# EAGLE design Tempest (EAGLE 6.6.0)

## Sheet 1 of 3
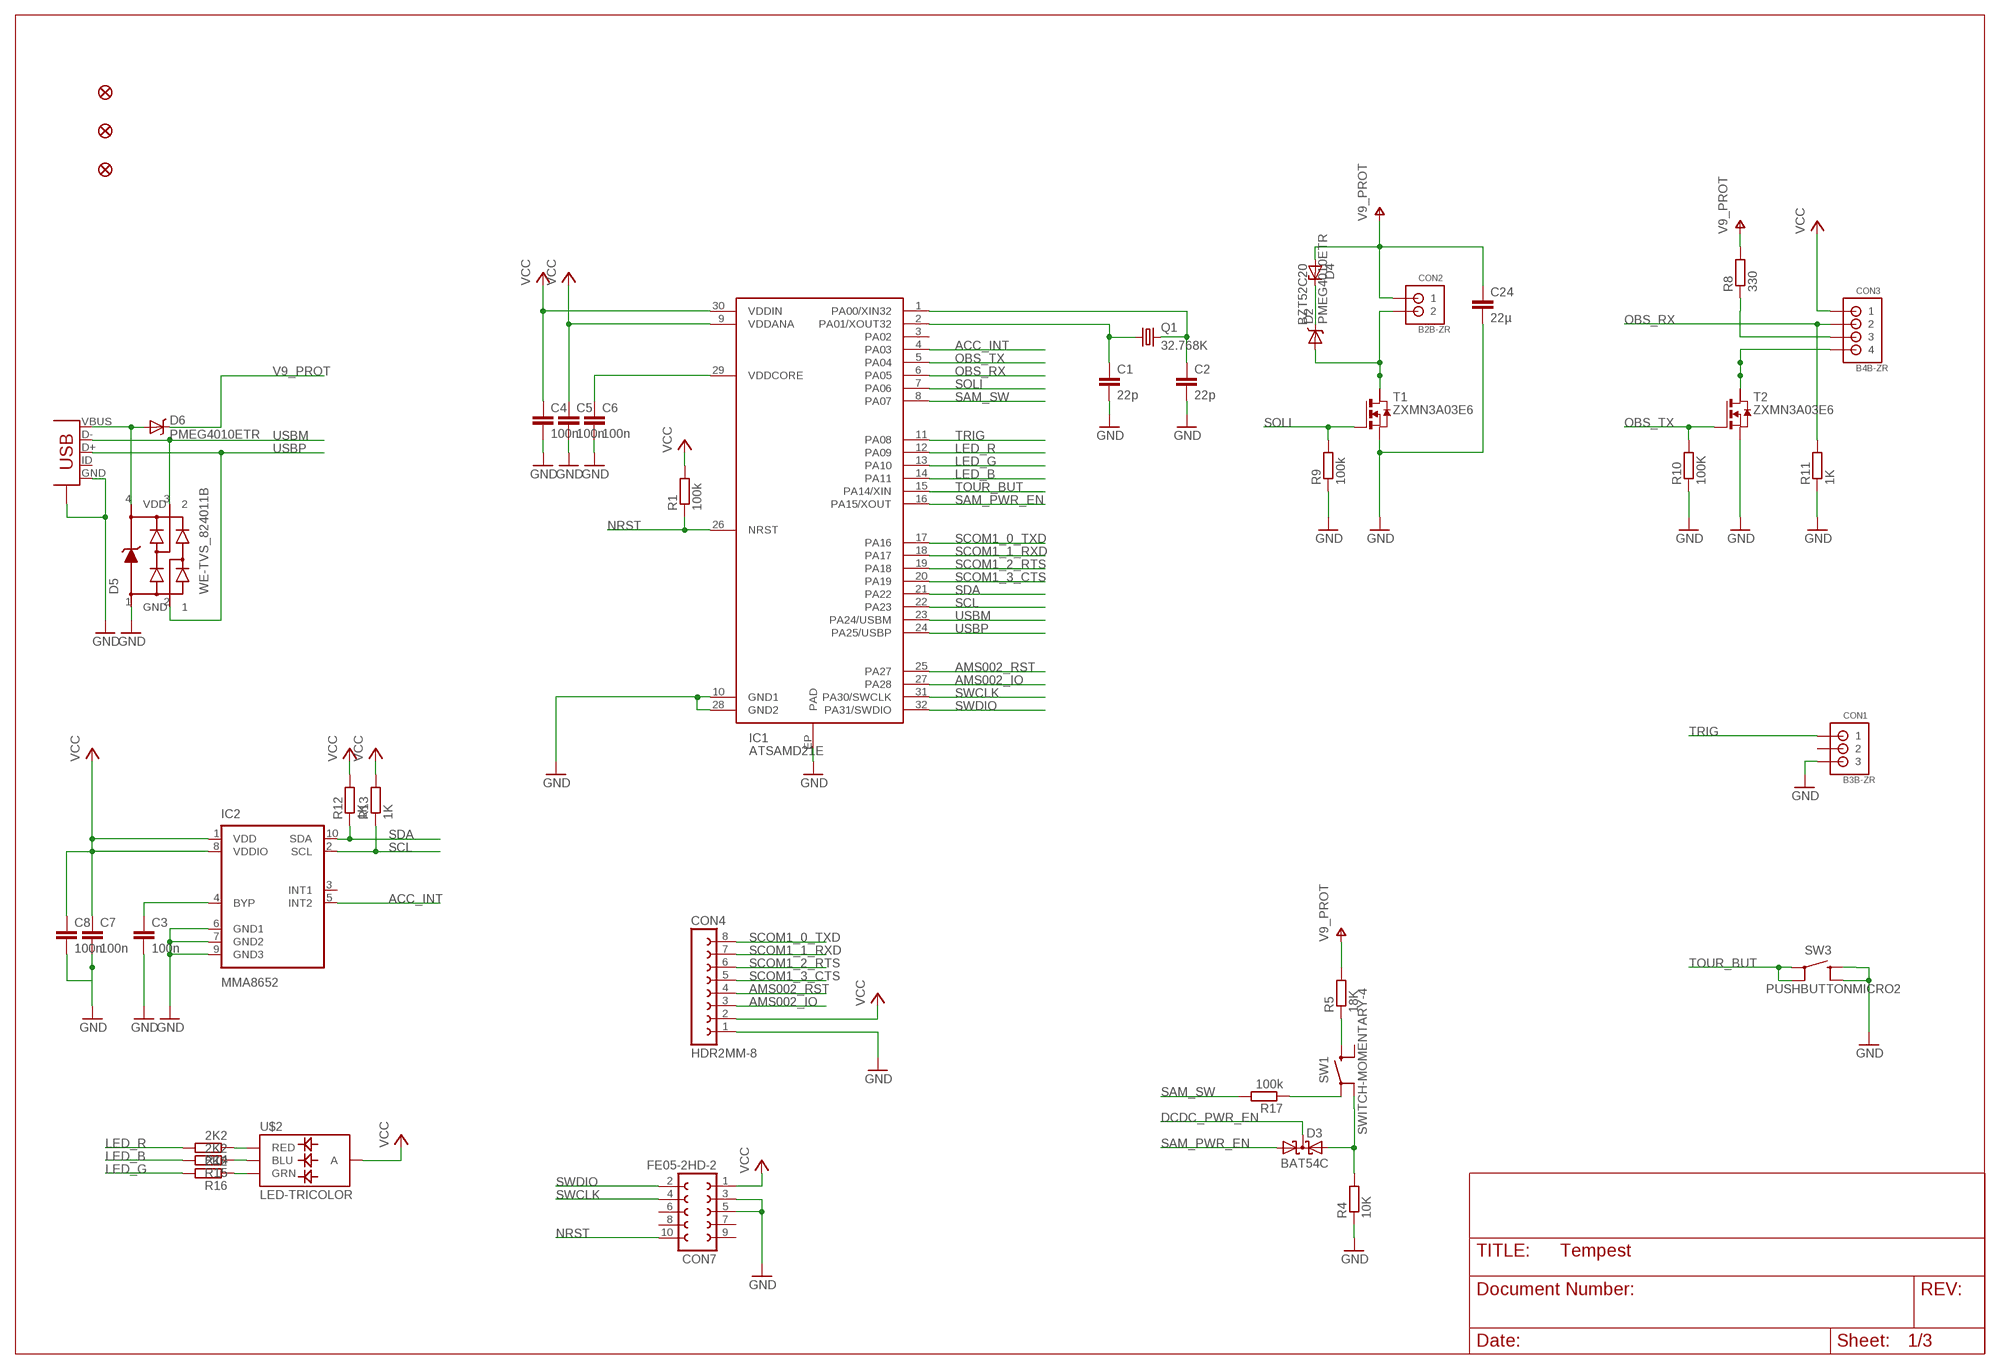
[diagram p0: schematic, sheet 1]

### Parts
C1  22p  C0603  [_0603MP]
C2  22p  C0603  [_0603MP]
C3  100n  C0603  [_0603MP]
C4  100n  C0603  [_0603MP]
C5  100n  C0603  [_0603MP]
C6  100n  C0603  [_0603MP]
C7  100n  C0603  [_0603MP]
C8  100n  C0603  [_0603MP]
C24  22µ  C-EUC1206  [C1206]
CON1  B3B-ZR  [S3B-ZR]
CON2  B2B-ZR  [S2B-ZR]
CON3  B4B-ZR  [S4B-ZR]
CON4  HDR2MM-8  [HDR2MM-8]
CON6  USB-MICRO-A  [USB-MICROB]
CON7  FE05-2HD-2  [FE02-2-HD-2]
D2  PMEG4010ETR  DIODE-SCHOTTKYSOD123  [SOD123]
D3  BAT54C  [SOT23]
D4  BZT52C20  ZENER-DIODESOD123  [SOD123]
D5  WE-TVS_824011B  [AUTOPILOT_SOT143B]
D6  PMEG4010ETR  DIODE-SCHOTTKYSOD123  [SOD123]
FID1  FIDUCIALUFIDUCIAL  [MICRO-FIDUCIAL]
FID2  FIDUCIALUFIDUCIAL  [MICRO-FIDUCIAL]
FID6  FIDUCIALUFIDUCIAL  [MICRO-FIDUCIAL]
IC1  ATSAMD21E  [QFN-32]
IC2  MMA8652  [DFN-10]
Q1  32.768K  CRYSTAL32X15  [XTAL_32X15]
R1  100k  R0603  [_0603MP]
R4  10K  R0603  [_0603MP]
R5  18K  R0603  [_0603MP]
R8  330  R-EU_R0805  [R0805]
R9  100k  R0603  [_0603MP]
R10  100K  R0603  [_0603MP]
R11  1K  R0603  [_0603MP]
R12  1K  R0603  [_0603MP]
R13  1K  R0603  [_0603MP]
R14  2K2  R0603  [_0603MP]
R15  2K2  R0603  [_0603MP]
R16  2K2  R0603  [_0603MP]
R17  100k  R0603  [_0603MP]
SW1  SWITCH-MOMENTARY-4  [TACTILE_SWITCH_TALL]
SW3  PUSHBUTTONMICRO2  [PUSHBUTTON-MICRO2]
T1  ZXMN3A03E6  NMOSSOT23-6  [SOT23-6]
T2  ZXMN3A03E6  NMOSSOT23-6  [SOT23-6]
U$2  LED-TRICOLOR  [LED-TRICOLOR-SMD]

### Nets
ACC_INT: IC1.4(PA03) IC2.5(INT2)
AMS002_IO: CON4.3 IC1.27(PA28)
AMS002_RST: CON4.4 IC1.25(PA27)
DCDC_PWR_EN: D3.3(CC) ; also sheet 3
GND: C1.2 C2.2 C3.2 C4.2 C5.2 C6.2 C7.2 C8.2 C24.2 CON1.3 CON4.1 CON6.GND CON6.GND@1(GND) CON7.3 CON7.5 D5.1(GND) IC1.10(GND1) IC1.28(GND2) IC1.EP(PAD) IC2.6(GND1) IC2.7(GND2) IC2.9(GND3) R4.1 R9.1 R10.1 R11.1 SW3.2A SW3.2B(2A) T1.4(S) T2.4(S) ; also sheet 3
LED_B: IC1.14(PA11) R15.2
LED_G: IC1.13(PA10) R16.2
LED_R: IC1.12(PA09) R14.2
N$1: C2.1 IC1.1(PA00/XIN32) Q1.2
N$2: C6.1 IC1.29(VDDCORE)
N$3: C1.1 IC1.2(PA01/XOUT32) Q1.1
N$5: D3.2(A2) R4.2 SW1.A2(1A)
N$6: CON2.2 D2.A T1.1(D) T1.2(D1) T1.6(D3)
N$7: R5.1 SW1.B1
N$8: R17.1 SW1.A1
N$10: C3.1 IC2.4(BYP)
N$15: CON3.4 T2.1(D) T2.2(D1) T2.6(D3)
N$16: CON3.3 R8.1
N$18: D2.C D4.C
N$25: CON6.VBUS D5.4(VDD) D6.A
N$30: R14.1 U$2.2(RED)
N$31: R15.1 U$2.3(BLU)
N$32: R16.1 U$2.4(GRN)
NRST: CON7.10 IC1.26(NRST) R1.1
OBS_RX: CON3.2 IC1.6(PA05) R11.2
OBS_TX: IC1.5(PA04) R10.2 T2.3(G)
SAM_PWR_EN: D3.1(A1) IC1.16(PA15/XOUT)
SAM_SW: IC1.8(PA07) R17.2
SCL: IC1.22(PA23) IC2.2(SCL) R13.1
SCOM1_0_TXD: CON4.8 IC1.17(PA16)
SCOM1_1_RXD: CON4.7 IC1.18(PA17)
SCOM1_2_RTS: CON4.6 IC1.19(PA18)
SCOM1_3_CTS: CON4.5 IC1.20(PA19)
SDA: IC1.21(PA22) IC2.10(SDA) R12.1
SOLI: IC1.7(PA06) R9.2 T1.3(G)
SWCLK: CON7.4 IC1.31(PA30/SWCLK)
SWDIO: CON7.2 IC1.32(PA31/SWDIO)
TOUR_BUT: IC1.15(PA14/XIN) SW3.1A SW3.1B(1A)
TRIG: CON1.1 IC1.11(PA08)
USBM: CON6.D- D5.3 IC1.23(PA24/USBM)
USBP: CON6.D+ D5.2 IC1.24(PA25/USBP)
V9_PROT: C24.1 CON2.1 D4.A D6.C R5.2 R8.2 ; also sheet 3
VCC: C4.1 C5.1 C7.1 C8.1 CON3.1 CON4.2 CON7.1 IC1.9(VDDANA) IC1.30(VDDIN) IC2.1(VDD) IC2.8(VDDIO) R1.2 R12.2 R13.2 U$2.1(A) ; also sheet 3
Unconnected: CON1.2 CON6.ID CON7.6 CON7.7 CON7.8 CON7.9 IC1.3(PA02) IC2.3(INT1) SW1.B2(2A) T1.5(D2) T2.5(D2)

## Sheet 2 of 3
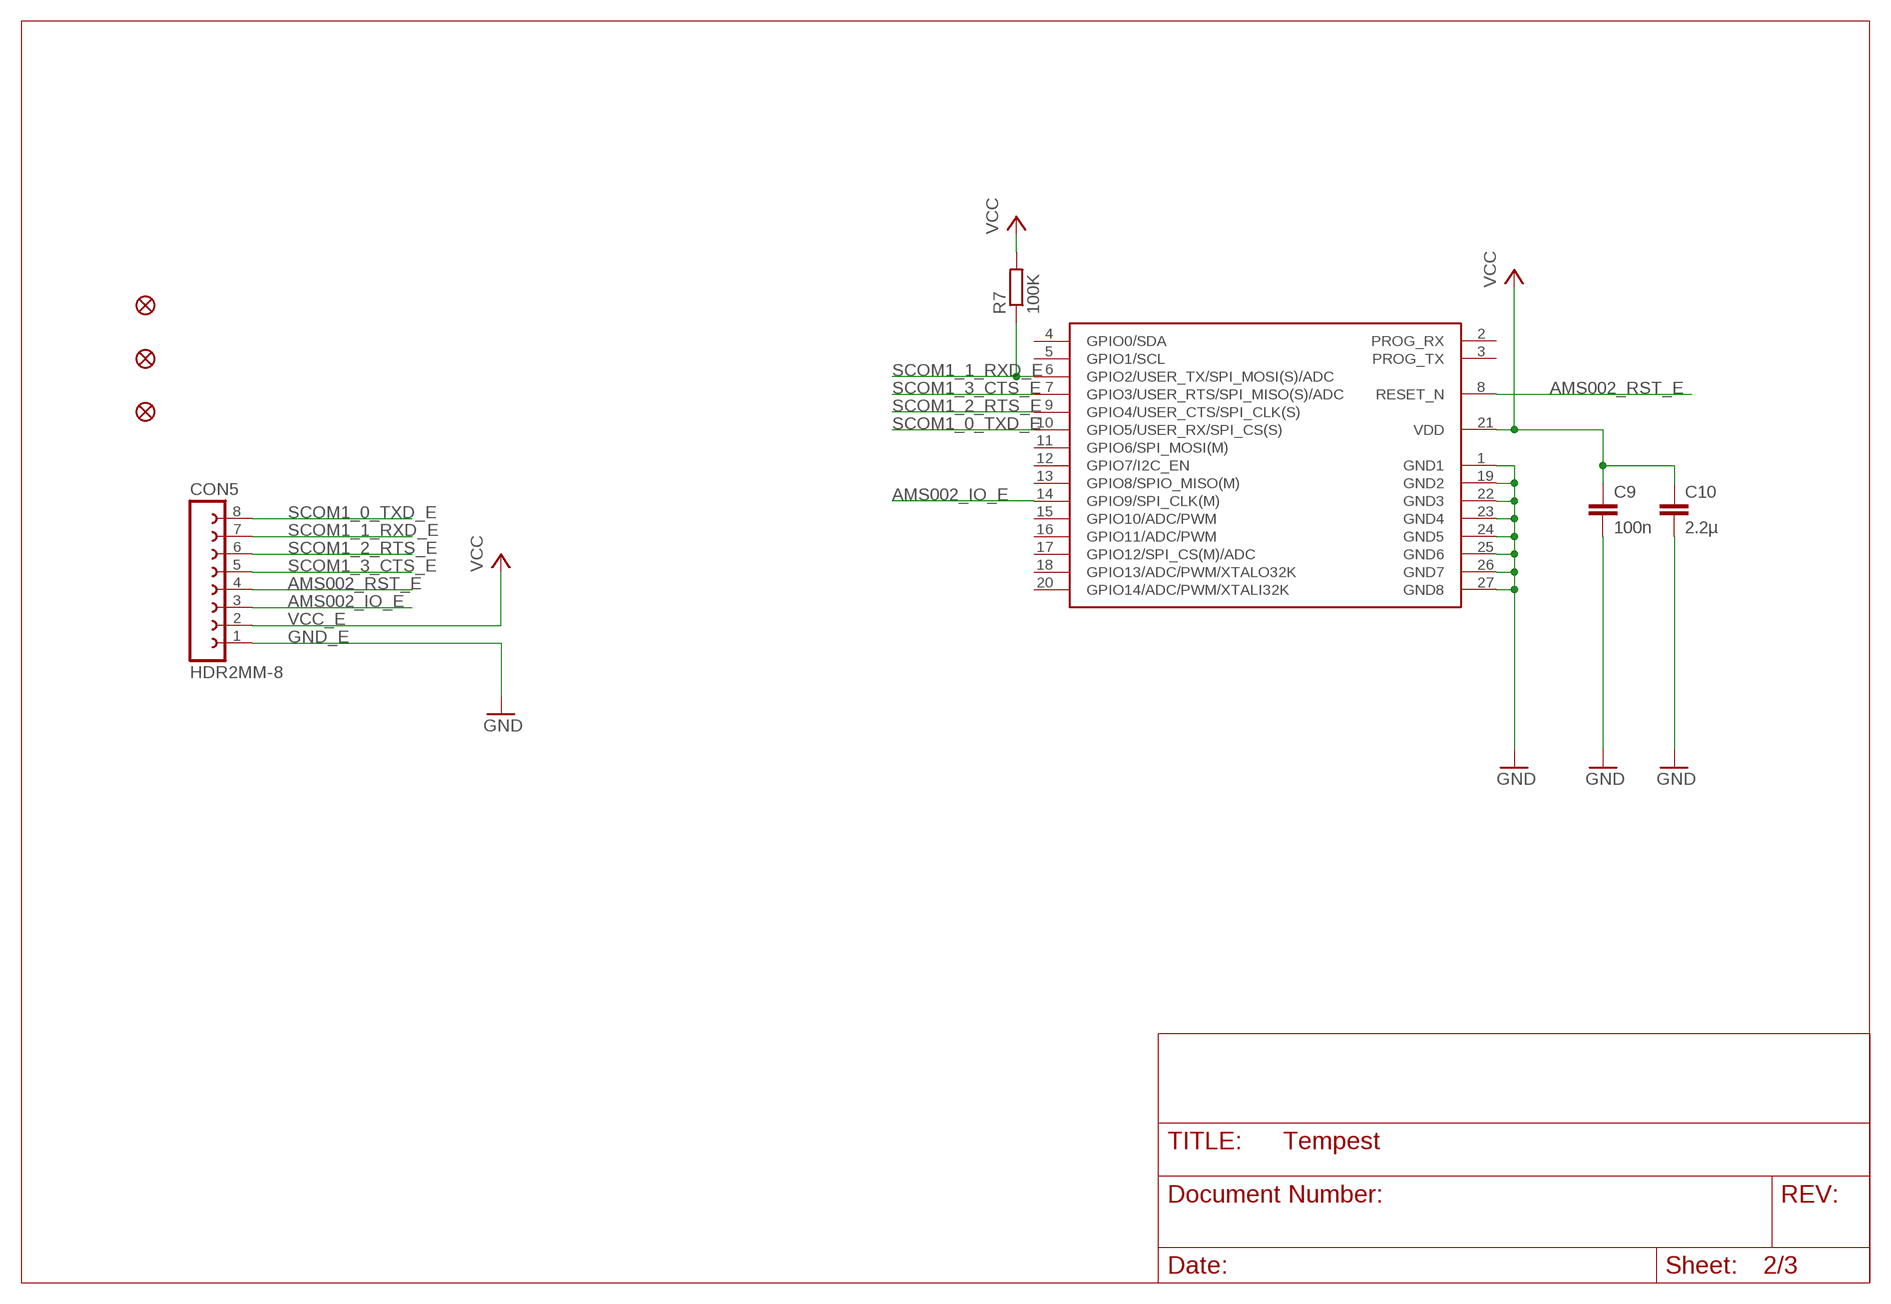
[diagram p1: schematic, sheet 2]

### Parts
C9  100n  C0603  [_0603MP]
C10  2.2µ  C0603  [_0603MP]
CON5  HDR2MM-8  [HDR2MM-8]
FID3  FIDUCIALUFIDUCIAL  [MICRO-FIDUCIAL]
FID4  FIDUCIALUFIDUCIAL  [MICRO-FIDUCIAL]
FID5  FIDUCIALUFIDUCIAL  [MICRO-FIDUCIAL]
R7  100K  R0603  [_0603MP]
U$1  AMS002  [AMS00X]

### Nets
AMS002_IO_E: CON5.3 U$1.14(GPIO9/SPI_CLK(M))
AMS002_RST_E: CON5.4 U$1.8(RESET_N)
GND_E: C9.2 C10.2 CON5.1 U$1.1(GND1) U$1.19(GND2) U$1.22(GND3) U$1.23(GND4) U$1.24(GND5) U$1.25(GND6) U$1.26(GND7) U$1.27(GND8) ; supply symbol labelled GND
SCOM1_0_TXD_E: CON5.8 U$1.10(GPIO5/USER_RX/SPI_CS(S))
SCOM1_1_RXD_E: CON5.7 R7.1 U$1.6(GPIO2/USER_TX/SPI_MOSI(S)/ADC)
SCOM1_2_RTS_E: CON5.6 U$1.9(GPIO4/USER_CTS/SPI_CLK(S))
SCOM1_3_CTS_E: CON5.5 U$1.7(GPIO3/USER_RTS/SPI_MISO(S)/ADC)
VCC_E: C9.1 C10.1 CON5.2 R7.2 U$1.21(VDD) ; supply symbol labelled VCC
Unconnected: U$1.2(PROG_RX) U$1.3(PROG_TX) U$1.4(GPIO0/SDA) U$1.5(GPIO1/SCL) U$1.11(GPIO6/SPI_MOSI(M)) U$1.12(GPIO7/I2C_EN) U$1.13(GPIO8/SPIO_MISO(M)) U$1.15(GPIO10/ADC/PWM) U$1.16(GPIO11/ADC/PWM) U$1.17(GPIO12/SPI_CS(M)/ADC) U$1.18(GPIO13/ADC/PWM/XTALO32K) U$1.20(GPIO14/ADC/PWM/XTALI32K)

## Sheet 3 of 3
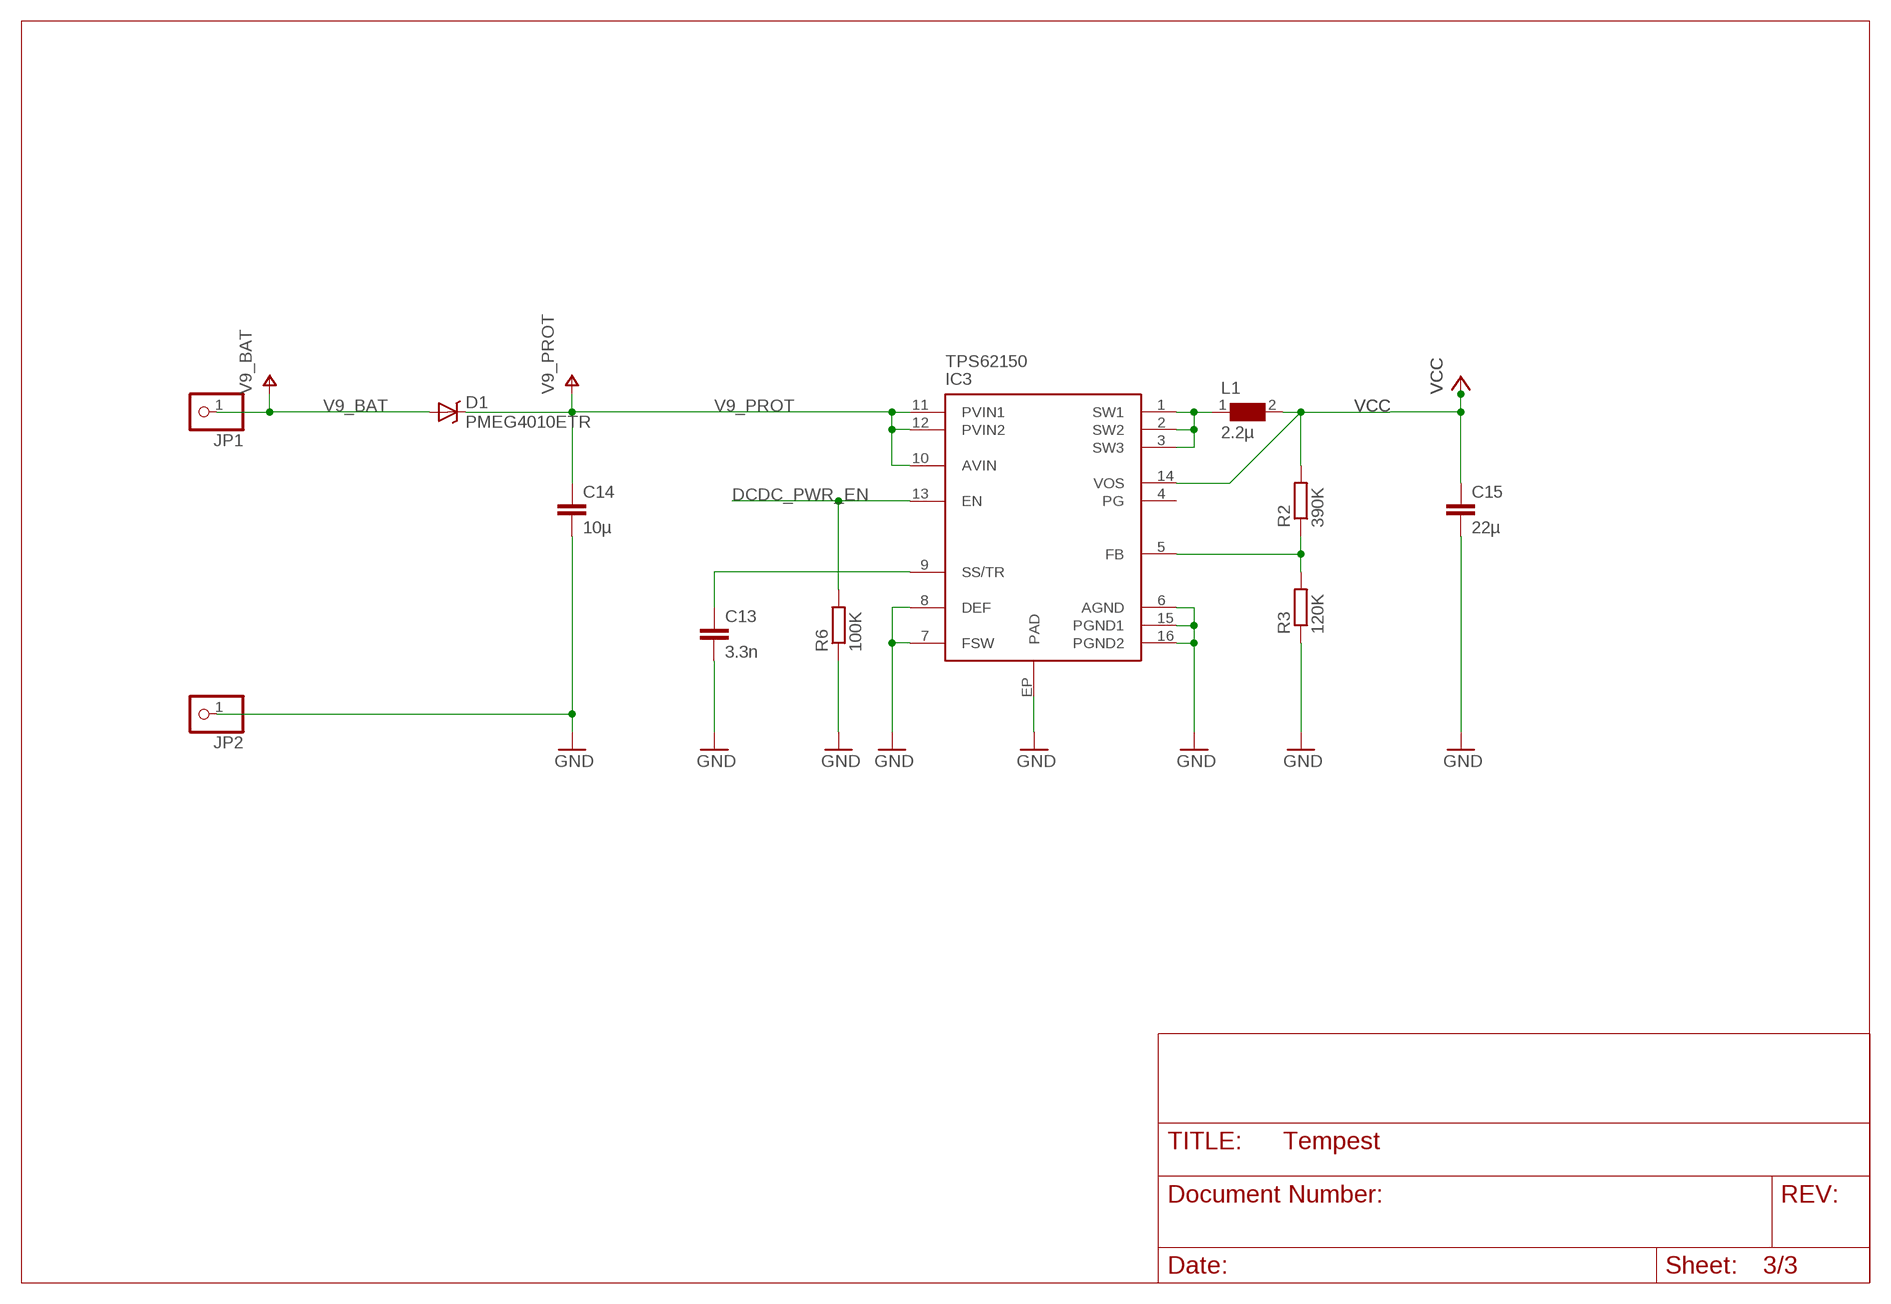
[diagram p2: schematic, sheet 3]

### Parts
C13  3.3n  C0603  [_0603MP]
C14  10µ  C-EUC1206  [C1206]
C15  22µ  C-EUC1206  [C1206]
D1  PMEG4010ETR  DIODE-SCHOTTKYSOD123  [SOD123]
IC3  TPS62150  [QFN-16]
JP1  PINHD-1X1  [1X01]
JP2  PINHD-1X1  [1X01]
L1  2.2µ  WE-TPC_2828  [WE-TPC_2828]
R2  390K  R0603  [_0603MP]
R3  120K  R0603  [_0603MP]
R6  100K  R0603  [_0603MP]

### Nets
DCDC_PWR_EN: IC3.13(EN) R6.2 ; also sheet 1
GND: C13.2 C14.2 C15.2 IC3.6(AGND) IC3.7(FSW) IC3.8(DEF) IC3.15(PGND1) IC3.16(PGND2) IC3.EP(PAD) JP2.1 R3.1 R6.1 ; also sheet 1
N$17: C13.1 IC3.9(SS/TR)
N$19: IC3.1(SW1) IC3.2(SW2) IC3.3(SW3) L1.1
N$20: IC3.5(FB) R2.1 R3.2
V9_BAT: D1.A JP1.1
V9_PROT: C14.1 D1.C IC3.10(AVIN) IC3.11(PVIN1) IC3.12(PVIN2) ; also sheet 1
VCC: C15.1 IC3.14(VOS) L1.2 R2.2 ; also sheet 1
Unconnected: IC3.4(PG)

## Power pins joined to a net without a drawn wire
GND: CON6.GND@2(GND) CON6.GND@3(GND) CON6.GND@4(GND) CON6.GND@5(GND) CON6.GND@6(GND)

## Library data of the parts
C1-C10 C13 = squirrel:C
C14 C15 C24 = squirrel:C-EU: CAPACITOR, European symbol
CON1 = squirrel:B3B-ZR: JST-ZH Connector 3 pol, 1.5mm pitch Package: B3B-ZR Source: http://www.jst-mfg.com/product/pdf/eng/eZH.pdf
CON2 = squirrel:B2B-ZR
CON3 = squirrel:B4B-ZR: JST-ZH Connector 4 pol, 1.5mm pitch Package: B4B-ZR Source: http://www.jst-mfg.com/product/pdf/eng/eZH.pdf
CON4 CON5 = squirrel:HDR2MM-8
CON6 = squirrel:USB-MICRO-A
CON7 = squirrel:FE05-2: FEMALE HEADER
D1 D2 D6 = squirrel:DIODE-SCHOTTKY: Commonly MBRA140.
D3 = diode:BAT54C: Schottky Diodes Source: Fairchild .. BAT54.pdf
D4 = squirrel:ZENER-DIODE: Z-Diode
D5 = squirrel:WE-TVS_824011: TVS Diode Array WE-TVS, High Speed Series - Low capazity - No leakage current - Low clamping voltage - high ESD voltage protection -- USB 1.0 - 2.0
FID1-FID6 = squirrel:FIDUCIAL: Fiducial Alignment Points Various fiducial points for machine vision alignment.
IC1 = squirrel:ATSAMD21E
IC2 = squirrel:MMA8652
IC3 = squirrel:TPS62150
JP1 JP2 = pinhead:PINHD-1X1: PIN HEADER
L1 = squirrel:WE-TPC: Shielded Tiny Power Inductor WE-TPC - Extremely flat power inductor - High current capability - High reliability and perfect soldering characteristics because of integrated soldering pad - magnetically shielded -- Portable power like PDA, digital camera, PCMICA-cards and displays -- DC/DC-converter -- Recommended for switching regulator IC's from Linear Technology, National Semiconductor, Texas Instruments and Fairchild Semiconductor
Q1 = squirrel:CRYSTAL: CRYSTAL
R1-R7 R9-R17 = squirrel:R
R8 = squirrel:R-EU_: RESISTOR, European symbol
SW1 = squirrel:SWITCH-MOMENTARY-4
SW3 = squirrel:PUSHBUTTON
T1 T2 = squirrel:NMOSSOT23-6: MOS FET
U$1 = AMS00x:AMS002
U$2 = squirrel:LED-TRICOLOR: Tri-Color LED SMD Proven layout and schematic for triple color LED in SMD package - common anode. Spark Fun Electronics SKU : COM-07844

## Board
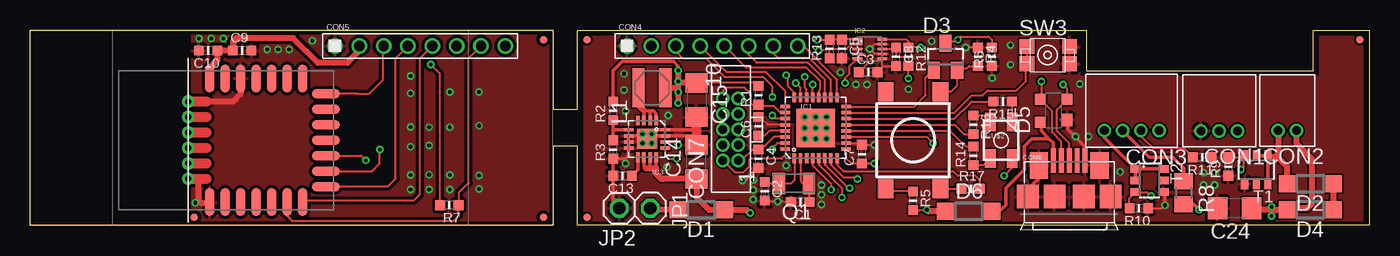
[diagram p3: board, top side]
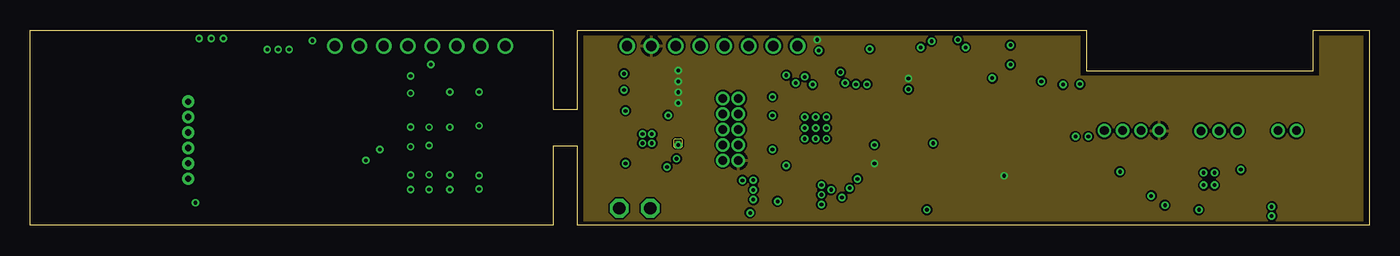
[diagram p4: board, inner layer Route2]
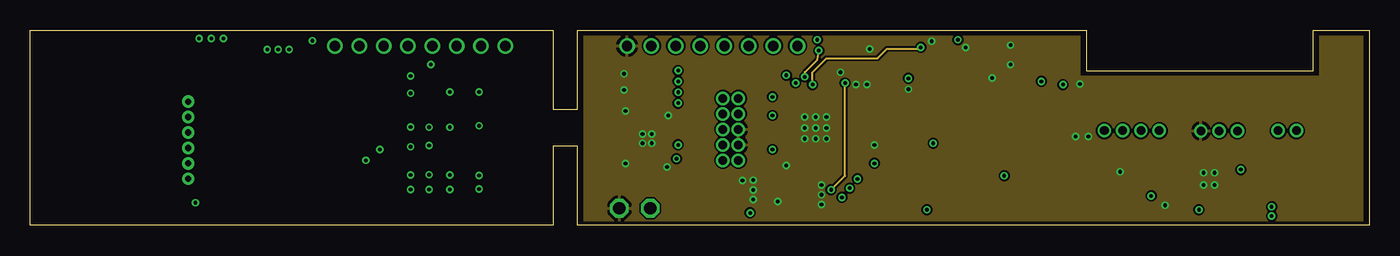
[diagram p5: board, inner layer Route15]
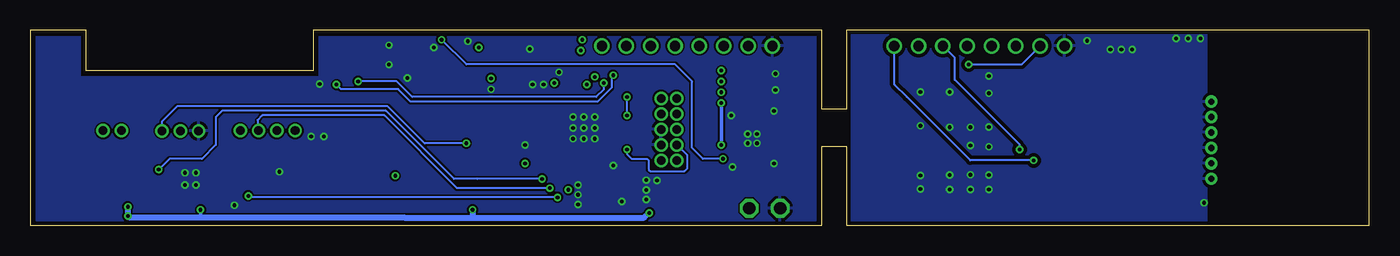
[diagram p6: board, bottom side, seen from below]

Size 109.98 x 16 mm. Coordinates in mm from the lower left corner, seen from the top.
Outline: 0,16 42.93,16 42.93,9.53 44.96,9.53 44.96,16 86.74,16 86.74,12.7 105.41,12.7 105.41,16 109.98,16 109.98,8.13 109.98,0 55.24,0 44.96,0 44.96,6.48 42.93,6.48 42.93,0 0,0 0,16
Copper layers (1*2+15*16): Top 0.035mm / dielectric 0.45mm / Route2 0.035mm / dielectric 0.45mm / Route15 0.035mm / dielectric 0.45mm / Bottom 0.035mm
Design rules "pcbpool2 *": minimum track width 0.15mm, minimum drill 0.3mm, track to track 0.15mm, track to pad 0.15mm, pad to pad 0.15mm, via to via 0.15mm, smd to smd 0.15mm, copper to edge 0.3mm, drill to drill 8mil, minimum pad ring 0.2mm, minimum via ring 0.15mm, stop-mask expansion 4mil, vias tented up to drill 0mil, thermal gap 10mil
tKeepout: area 107.9,0 to 110,16; area 45,0 to 47,16
tRestrict: area 50.3,7.9 to 50.9,8.3; area 51.4,6.7 to 51.8,7.1; area 50.4,6 to 50.9,6.3; area 64.4,9.5 to 64.6,9.9; area 66,7.6 to 66.3,8.3; area 62.7,7.7 to 63,8.3; area 64.3,6.1 to 64.9,6.5; area 62,2.4 to 63.4,4.3

### Footprints (pad centres in the part's own frame; a part is rotated, then mirrored left to right if it is on the bottom)
_0603MP = smd 0.8 x 0.8: 1 -0.762,0; 2 0.762,0
C1206 = smd 1.6 x 1.8: 1 -1.4,0; 2 1.4,0
S3B-ZR = drill 0.7 pad 1.1: 1 -1.5,0; 2 0,0; 3 1.5,0
S2B-ZR = drill 0.7 pad 1.1: 1 0,-1.3; 2 1.5,-1.3
S4B-ZR = drill 0.7: 1 1.5,-1.3; 2 3,-1.3; 3 4.5,-1.3; 4 6,-1.3
HDR2MM-8 = drill 0.85: 1 0,0; 2 2,0; 3 4,0; 4 6,0; 5 8,0; 6 10,0; 7 12,0; 8 14,0
USB-MICROB = smd 0.4 x 2: D+ 0,2.9; D- -0.65,2.9; GND 1.3,2.9; ID 0.65,2.9; VBUS -1.3,2.9 | smd 1.8 x 1.9: GND@1 -1.2,-0.05; GND@2 -3.4,-0.05; GND@3 3.4,-0.05; GND@4 1.2,-0.05 | smd 1.5 x 2.2: GND@5 -2.5,2.5; GND@6 2.5,2.5
FE02-2-HD-2 = drill 0.7 pad 1.1: 1 -2.54,0; 2 -2.54,1.27; 3 -1.27,0; 4 -1.27,1.27; 5 0,0; 6 0,1.27; 7 1.27,0; 8 1.27,1.27; 9 2.54,0; 10 2.54,1.27
SOD123 = smd 1.4 x 1.4: A 1.9,0; C -1.9,0
SOT23 = smd 1 x 1.4: 1 -0.95,-1.1; 2 0.95,-1.1; 3 0,1.1
AUTOPILOT_SOT143B = smd 1 x 0.9: 1 -0.75,-1.1 | smd 0.9 x 0.9: 2 0.95,-1.1; 3 0.95,1.1; 4 -0.95,1.1
MICRO-FIDUCIAL = smd 0.635 x 0.635: 1 0,0
QFN-32 = smd 0.285 x 0.8: 1 -1.75,-2.5; 2 -1.25,-2.5; 3 -0.75,-2.5; 4 -0.25,-2.5; 5 0.25,-2.5; 6 0.75,-2.5; 7 1.25,-2.5; 8 1.75,-2.5; 17 1.75,2.5; 18 1.25,2.5; 19 0.75,2.5; 20 0.25,2.5; 21 -0.25,2.5; 22 -0.75,2.5; 23 -1.25,2.5; 24 -1.75,2.5 | smd 0.8 x 0.285: 9 2.5,-1.75; 10 2.5,-1.25; 11 2.5,-0.75; 12 2.5,-0.25; 13 2.5,0.25; 14 2.5,0.75; 15 2.5,1.25; 16 2.5,1.75; 25 -2.5,1.75; 26 -2.5,1.25; 27 -2.5,0.75; 28 -2.5,0.25; 29 -2.5,-0.25; 30 -2.5,-0.75; 31 -2.5,-1.25; 32 -2.5,-1.75 | smd 3.15 x 3.15: EP 0,0
DFN-10 = smd 0.8 x 0.22: 1 -1.01,0.8; 2 -1.01,0.4; 3 -1.01,0; 4 -1.01,-0.4; 5 -1.01,-0.8; 6 1.01,-0.8; 7 1.01,-0.4; 8 1.01,0; 9 1.01,0.4; 10 1.01,0.8
QFN-16 = smd 0.285 x 0.8: 1 -1.75,-2.5; 2 -1.25,-2.5; 3 -0.75,-2.5; 4 -0.25,-2.5; 9 -0.25,0.5; 10 -0.75,0.5; 11 -1.25,0.5; 12 -1.75,0.5 | smd 0.8 x 0.285: 5 0.5,-1.75; 6 0.5,-1.25; 7 0.5,-0.75; 8 0.5,-0.25; 13 -2.5,-0.25; 14 -2.5,-0.75; 15 -2.5,-1.25; 16 -2.5,-1.75 | smd 1.65 x 1.65: EP -1,-1
1X01 = drill 1.016 octagon: 1 0,0
WE-TPC_2828 = smd 3.2 x 1: 1 0,1.1; 2 0,-1.1
XTAL_32X15 = smd 1 x 1.8: 1 -2,0; 2 0.5,0
R0805 = smd 1.3 x 1.5: 1 -0.95,0; 2 0.95,0
TACTILE_SWITCH_TALL = smd 1.55 x 1.3: A1 -3.975,-2.25; A2 3.975,-2.25; B1 -3.975,2.25; B2 3.975,2.25
PUSHBUTTON-MICRO2 = smd 1.2 x 1.2: 1A -1.7,0.7; 1B -1.7,-0.7; 2A 1.8,0.7; 2B 1.8,-0.7
SOT23-6 = smd 0.6 x 0.9: 1 -0.95,-1.15; 2 0,-1.15; 3 0.95,-1.15; 4 0.95,1.15; 5 0,1.15; 6 -0.95,1.15
AMS00X = smd 0.762 x 2.286: 1 10.16,10.795; 2 8.89,10.795; 3 7.62,10.795; 4 6.35,10.795; 5 5.08,10.795; 6 3.81,10.795; 7 2.54,10.795; 15 2.54,0.635; 16 3.81,0.635; 17 5.08,0.635; 18 6.35,0.635; 19 7.62,0.635; 20 8.89,0.635; 21 10.16,0.635 | smd 2.286 x 0.762: 8 0.635,9.525; 9 0.635,8.255; 10 0.635,6.985; 11 0.635,5.715; 12 0.635,4.445; 13 0.635,3.175; 14 0.635,1.905 | drill 0.5 pad 1: 22 11.938,2.54; 23 11.938,3.81; 24 11.938,5.08; 25 11.938,6.35; 26 11.938,7.62; 27 11.938,8.89
LED-TRICOLOR-SMD = smd 1.5 x 0.9: 1 1.5,0.9; 2 1.5,-0.9; 3 -1.5,0.9; 4 -1.5,-0.9

### Placement (x,y rotation side)
C1  63.25,1.91 180 top
C2  60.33,2.79 270 top
C3  68.83,12.57 0 top
C4  59.82,5.46 270 top
C5  66.67,14.48 270 top
C6  59.82,8.13 90 top
C7  68.33,5.84 90 top
C8  71.12,13.84 270 top
C9  17.4,14.35 0 top
C10  14.61,14.35 180 top
C13  48.64,4.06 180 top
C14  54.74,5.21 90 top
C15  54.74,10.29 270 top
C24  98.93,1.4 180 top
CON1  97.66,7.75 180 top
CON2  104.01,6.48 180 top
CON3  94.23,6.48 180 top
CON4  49.02,14.73 0 top
CON5  25.02,14.73 0 top
CON6  85.34,2.41 0 top
CON7  58.17,7.87 90 top
D1  55.12,1.27 180 top
D2  105.16,3.43 180 top
D3  75.18,13.84 0 top
D4  105.16,1.27 180 top
D5  84.07,9.4 90 top
D6  77.09,1.14 0 top
FID1  45.72,15.25 270 top
FID2  109.22,15.25 270 top
FID3  13.46,0.68 270 top
FID4  42.16,15.25 270 top
FID5  42.16,0.65 270 top
FID6  45.72,0.65 270 top
IC1  64.52,8 0 top
IC2  68.96,14.48 0 top
IC3  49.66,6.1 180 top
JP1  50.93,1.4 270 top
JP2  48.39,1.4 180 top
L1  51.05,11.3 90 top
Q1  61.98,3.43 180 top
R1  59.82,10.67 90 top
R2  47.88,9.4 90 top
R3  47.88,6.22 90 top
R4  77.85,13.84 270 top
R5  72.52,2.01 270 top
R6  78.99,13.84 90 top
R7  34.42,1.65 180 top
R8  94.74,2.67 270 top
R9  98.42,4.83 90 top
R10  91.06,1.4 180 top
R11  96.27,5.59 180 top
R12  72.14,13.84 270 top
R13  65.66,14.48 90 top
R14  77.47,5.71 90 top
R15  79.88,10.16 180 top
R16  77.47,8.26 270 top
R17  77.25,3 0 top
SW1  72.52,6.99 90 top
SW3  83.57,13.97 0 top
T1  100.71,4.57 180 top
T2  91.95,3.68 270 top
U$1  24.89,12.7 180 top
U$2  79.76,6.99 270 top

### Tracks (layer width: path | path; a pad name or v marks a point on that pad's centre or on a via)
ACC_INT  (via drill 0.3)
  Top 0.15: IC1.4 64.27,4.95 65.79,3.43 v65.79,2.92 | v66.93,11.68 66.93,12.06 67.31,12.45 67.31,13.08 67.44,13.21 67.56,13.34 67.61,13.34 IC2.5
  Route15 0.15: v65.79,2.92 66.93,4.06 v66.93,11.68
AMS002_IO  (via drill 0.3)
  Top 0.15: CON4.3 53.02,14.29 53.59,13.72 55.5,13.72 57.02,12.19 60.2,12.19 60.96,11.43 v60.96,10.54 | IC1.27 61.23,8.75 v60.96,9.02
  Bottom 0.15: v60.96,9.02 v60.96,10.54
AMS002_IO_E
  Top 0.15: U$1.14 26.92,10.79 27.81,10.79 28.96,11.94 28.96,14.67 CON5.3
AMS002_RST
  Top 0.15: IC1.25 62.02,11.01 60.45,12.57 57.18,12.57 CON4.4
AMS002_RST_E
  Top 0.15: U$1.8 29.34,3.17 30,3.84 30,13.72 CON5.4
DCDC_PWR_EN  (via drill 0.3)
  Top 0.15: D3.3 75.23,15.11 76.05,15.11 v76.2,15.24 76.43,15.49 78.74,15.49 78.99,15.24 R6.2 | IC3.13 52.16,5.75 52.45,5.46 v53.09,5.46
  Bottom 0.15: v53.09,5.46 54.74,5.46 55.63,6.35 55.63,11.81 57.02,13.21 74.17,13.21 v76.2,15.24
GND  (via drill 0.3)
  Top 0.15: IC1.28 60.58,8.25 60.07,8.76 59.94,8.76 C6.2 | 54.74,7.11 C14.2 | R4.1 77.09,14.61 v76.83,14.61 | C1.2 v61.4,1.96 60.45,1.96 C2.2 | IC1.10 68.18,6.75 C7.2 v69.34,6.6 | 93.22,2.61 T2.4 | R10.1 92.96,1.4 v93.22,1.65 | T1.4 | C3.2 69.97,12.95 IC2.6 69.97,13.09 69.98,13.08 C8.2 | IC2.7 69.36,14.08 69.22,14.22 69.22,14.73 | 69.22,14.73 69.34,14.86 | IC2.9 69.36,14.88 69.22,14.73 | v51.05,7.49 51.02,7.46 51.02,7.45
  Top 0.3: JP2.1 47.88,1.91 C13.2 R3.1 48.9,5.46 49.16,5.72 IC3.8 IC3.7 IC3.6 50.15,7.35 v50.29,7.49 | IC3.16 53.21,7.85 54.71,7.85 54.74,7.87 | IC3.15 53.21,7.35 | IC3.15 54.63,7.35 54.74,7.24 | IC3.15 51.2,7.35 v51.05,7.49 | v51.05,7.49 v51.05,6.73 v50.29,6.73 | v51.05,7.49 v50.29,7.49 | v50.29,7.49 v50.29,6.73 | v50.29,7.49 v50.29,6.73 | v93.22,1.65 93.22,2.61 T2.4 | CON6.GND 86.64,6.45 85.22,7.87 85.22,8.61 D5.1 | CON6.GND@5 82.84,3.85 82.04,3.05 82.04,2.46 CON6.GND@2 | 51.92,7.85 51.62,7.85 51.52,7.75 51.32,7.75 51.02,7.45 | 59.8,4.8 58.7,3.7 58.5,3.7 v58.5,3.68
  Top 0.8: C15.2 54.74,7.87 54.74,7.75 | 54.74,7.75 54.74,7.24 | 54.74,7.24 54.74,7.11 54.74,7.24 | 54.74,7.24 54.74,7.75
  other vias: 97.28,4.32 97.28,3.3 96.39,4.32 66.55,12.57 68.96,14.48 72.14,11.18 74.04,15.11 48.9,5.08 48.9,9.4 48.77,12.45 96.39,3.3 65.41,8.89 65.41,8 65.41,7.11 64.52,7.11 64.52,8 64.52,8.89 63.63,8.89 63.63,8 63.63,7.11 65,3.31 65,2.5 65,1.71 59.4,3.71 59.4,2.9 59.4,2.1 62.09,4.91 48.77,11.1 52.4,9.03 52.3,4.8 68.72,11.57 67.82,11.57 79.02,12.09 86.22,11.59 86.92,7.29 85.87,7.29 80.52,14.79 80.52,13.19 89.52,4.39
  pour Top: 109.47,15.49 105.92,15.49 105.92,12.19 86.23,12.19 86.23,15.49 45.47,15.49 45.47,0.38 109.47,0.38
  pour Bottom: 109.47,15.49 105.92,15.49 105.92,12.19 86.23,12.19 86.23,15.49 45.47,15.49 45.47,0.38 109.47,0.38
  pour Route15: 109.47,15.49 105.92,15.49 105.92,12.19 86.23,12.19 86.23,15.49 45.47,15.49 45.47,0.38 109.47,0.38
GND_E  (via drill 0.3)
  Top 0.5: U$1.19 17.27,10.79 16.64,10.16 U$1.22 | U$1.1 14.1,1.78 13.84,2.03 13.84,3.56 13.72,3.68 U$1.27
  other vias: 15.86,15.35 14.86,15.35 13.86,15.35 13.56,1.85 19.46,14.45 20.36,14.45 21.26,14.45 23.16,15.15 31.23,12.25 31.23,10.85 31.23,8.08 31.23,6.45 31.23,4.12 31.23,2.95 32.76,8.05 32.76,6.55 32.76,4.15 32.76,2.95 34.46,8.05 34.46,4.12 34.46,2.95 34.46,10.95 36.86,10.95 36.86,8.18 36.86,4.09 36.86,2.98
  pour Bottom (isolate 0.3): 42.55,15.62 42.55,0.25 13.21,0.25 13.21,15.62
  pour Top (isolate 0.25): 42.55,15.62 42.55,0.25 13.21,0.25 13.21,15.62
LED_B
  Top 0.15: IC1.14 75.93,8.75 77.22,10.03 77.34,10.16 R15.2
LED_G
  Top 0.15: IC1.13 75.95,8.25 76.71,7.49 R16.2
LED_R
  Top 0.15: IC1.12 75.56,7.75 76.83,6.48 R14.2
N$1
  Top 0.15: IC1.1 62.77,3.71 62.48,3.43 Q1.2 60.45,3.43 C2.1
N$2
  Top 0.15: IC1.29 60.71,7.75 60.33,7.37 C6.1
N$3
  Top 0.15: IC1.2 63.27,3.66 63.5,3.43 Q1.1 63.98,1.81 C1.1
N$4
  Route2 0: 52.96,7.11 52.83,6.99 52.83,6.48 52.96,6.35 53.47,6.35 53.59,6.48 53.59,6.99 53.47,7.11 52.96,7.11
N$5
  Top 0.15: R4.2 77.09,13.08 76.88,12.87 76.26,12.87 D3.2 76.13,11.46 75.62,10.95 74.78,10.95 SW1.A2
N$6
  Top 0.15: 103.25,3.42 D2.A | 101.8,5.59 T1.1
  Top 0.3: T1.6 T1.1 T1.2
  Top 0.5: CON2.2 102.51,5.87 102.36,5.71 | 102.36,5.71 102.23,5.59 101.8,5.59 | D2.A 103.26,4.82 102.36,5.71
N$7
  Top 0.15: R5.1 70.33,2.77 SW1.B1
N$8
  Top 0.15: SW1.A1 R17.1
N$10
  Top 0.15: IC2.4 68.47,14.08 68.71,13.84 68.71,13.21 C3.1
N$15
  Top 0.3: CON3.4 88.23,7.2 T2.1 | T2.2 T2.1 | T2.6 T2.1
N$16
  Top 0.3: R8.1 94.74,4.7 93.85,5.59 91.92,5.59 CON3.3
N$17
  Top 0.3: IC3.9 49.91,4.57 C13.1
N$18
  Top 0.5: D2.C D4.C
N$19
  Top 0.3: IC3.3 50.41,9.41 50.65,9.4 50.93,9.4 | 49.78,11.26 L1.1 49.95,9.86 | IC3.1 51.41,9.17 51.18,9.4 50.93,9.4 | IC3.2 50.91,9.38 50.93,9.4
  Top 0.5: 49.95,9.86 50.41,9.41
N$20
  Top 0.3: IC3.5 47.91,7.85 | 47.91,7.85 47.88,7.87 R2.1 | R3.2 47.88,7.82 47.91,7.85
N$25
  Top 0.15: CON6.VBUS 84.04,6.76 83.69,7.11 | 83.06,8.36 D5.4 | 79.63,1.14 D6.A
  Top 0.3: 83.69,7.11 83.06,7.75 83.06,8.36 | CON6.VBUS 84.04,6.76 83.69,7.11 | 83.69,7.11 82.3,7.11 81.66,6.48 81.66,4.57 80.14,3.05 80.14,1.65 79.63,1.14
N$30
  Top 0.15: R14.1 78.32,4.95 U$2.2
N$31
  Top 0.15: R15.1 80.64,8.5 U$2.3
N$32
  Top 0.15: R16.1 78.32,9.02 U$2.4
NRST
  Top 0.15: IC1.26 61.62,9.25 61.09,9.78 59.94,9.78 R1.1 59.44,9.78 59.18,10.03 59.18,10.79 58.67,11.3 57.15,11.3 56.9,11.05 56.9,10.45 CON7.10
OBS_RX  (via drill 0.3)
  Top 0.15: IC1.6 65.27,4.96 66.67,3.56 67.18,3.05 v67.31,3.05 | R11.2 94.74,6.35 92.2,6.35 91.31,7.24 91.31,7.7 CON3.2
  Bottom 0.15: v67.31,3.05 73.41,3.05 74.93,3.05 80.9,9.02 90.93,9.02 91.31,8.64 91.31,7.86 CON3.2
OBS_TX  (via drill 0.3)
  Top 0.15: IC1.5 64.77,4.96 66.67,3.05 v66.67,2.29 | R10.2 90.3,2.23 T2.3 91.75,2.73 v92.08,2.41
  Bottom 0.15: v66.67,2.29 91.95,2.29 v92.08,2.41
SAM_PWR_EN
  Top 0.15: IC1.16 72.62,9.75 73.53,10.67 73.53,12.17 D3.1
SAM_SW
  Top 0.15: IC1.8 66.27,4.98 66.8,4.45 74.42,4.45 75.81,4.45 76.2,4.05 77.65,4.05 78.01,3.69 R17.2
SCL  (via drill 0.3)
  Top 0.15: IC1.22 63.77,11.16 63.63,11.3 v63.63,12.19 | v64.77,14.35 65.53,14.48 | 65.53,14.48 67.06,14.48 67.44,14.86 67.46,14.88 IC2.2 | R13.1 65.66,14.48 65.53,14.48
  Route15 0.15: v63.63,12.19 63.63,12.57 64.64,13.59 v64.77,14.35
SCOM1_0_TXD
  Top 0.15: CON4.8 63.5,14.73 66.14,12.09 66.27,11.97 IC1.17
SCOM1_0_TXD_E  (via drill 0.3)
  Top 0.15: U$1.10 27.18,5.71 v27.56,5.33
  Bottom 0.15: v27.56,5.33 32.77,5.33 37.97,10.54 38.99,11.56 38.99,14.7 CON5.8
SCOM1_1_RXD
  Top 0.15: 61.09,14.67 CON4.7 61.09,14.67 | 61.09,14.67 61.09,14.1 61.47,13.72 63.5,13.72 64.01,13.72 65.77,11.96 IC1.18
SCOM1_1_RXD_E
  Top 0.15: U$1.6 21.08,0.76 21.34,0.51 21.46,0.38 34.16,0.38 34.8,0.38 35.18,0.76 R7.1 35.18,2.67 36,3.49 36,13.72 CON5.7
SCOM1_2_RTS
  Top 0.15: CON4.6 59.05,14.7 59.05,13.97 59.69,13.34 63.37,13.34 63.88,13.34 65.27,11.95 IC1.19
SCOM1_2_RTS_E  (via drill 0.3)
  Top 0.15: U$1.9 28.07,4.45 28.7,5.08 v28.7,6.22
  Bottom 0.15: v28.7,6.22 28.7,6.6 34.04,11.94 34.04,13.75 CON5.6
SCOM1_3_CTS
  Top 0.15: CON4.5 58.8,12.95 63.25,12.95 63.75,12.95 64.77,11.94 | 64.77,11.94 | IC1.20 64.77,11.04 64.9,11.18 64.9,11.81 64.77,11.94
SCOM1_3_CTS_E
  Top 0.15: U$1.7 22.48,2.03 31.5,2.03 32,2.54 32,13.72 CON5.5
SDA  (via drill 0.3)
  Top 0.15: IC1.21 64.27,11.17 v64.26,11.56 | IC2.10 71.97,15.28 72.14,15.11 R12.1 v73.15,14.61
  Route15 0.15: v64.26,11.56 64.26,12.57 65.41,13.72 69.6,13.72 70.36,14.48 73.03,14.48 v73.15,14.61
SOLI  (via drill 0.3)
  Top 0.15: IC1.7 65.77,4.97 66.8,3.94 67.82,3.94 v67.94,3.81 | R9.2 99.63,5.59 | 99.63,5.59 T1.3 | v99.44,4.57 99.69,4.83 99.69,5.59 99.63,5.59
  Bottom 0.15: v67.94,3.81 73.28,3.81 75.18,3.81 80.77,9.4 94.23,9.4 94.74,8.89 94.74,6.6 95.89,5.46 98.55,5.46 v99.44,4.57
SWCLK  (via drill 0.3)
  Top 0.15: IC1.31 61.36,6.75 60.96,6.35 v60.96,6.22
  Bottom 0.15: v60.96,6.22 60.96,5.84 60.58,5.46 59.31,5.46 59.18,5.33 59.18,4.57 59.05,4.45 56.26,4.45 56.01,4.7 56.01,5.74 CON7.4
SWDIO
  Top 0.15: CON7.2 57.95,4.32 58.55,4.32 59.05,4.83 59.05,5.33 59.18,5.46 60.58,5.46 61.72,5.46 62.02,5.75 IC1.32
TOUR_BUT
  Top 0.15: 81.8,13.21 SW3.1B | IC1.15 75.93,9.25 77.34,10.67 78.23,10.67 78.61,11.05 81.03,11.05 81.79,11.81 81.79,13.19 SW3.1B | SW3.1A SW3.1B
TRIG  (via drill 0.3)
  Top 0.15: IC1.11 73.65,7.25 v74.17,6.73
  Bottom 0.15: 99.19,7.77 CON1.1 99.16,8.53 97.92,9.78 80.64,9.78 77.6,6.73 v74.17,6.73
USBM  (via drill 0.3)
  Top 0.15: CON6.D- 84.69,6.87 83.95,7.62 83.95,9.38 D5.3 83.06,10.43 v83.06,11.81 | IC1.23 63.27,11.28 v62.87,11.68
  Bottom 0.15: v83.06,11.81 79.88,11.81 78.61,10.54 63.5,10.54 62.87,11.18 v62.87,11.68
USBP  (via drill 0.3)
  Top 0.15: CON6.D+ 85.34,6.73 84.33,7.75 84.33,9.5 D5.2 85.17,11.22 v84.84,11.56 | 62.74,10.53 IC1.24 62.77,10.89 62.23,11.43 62.23,12.19 v62.1,12.32
  Bottom 0.15: v62.1,12.32 62.23,12.19 62.23,11.3 63.37,10.16 78.74,10.16 79.76,11.18 84.45,11.18 v84.84,11.56
V9_BAT
  Top 0.5: D1.A 51.05,1.27 JP1.1
V9_PROT  (via drill 0.3)
  Top 0.15: D1.C 57.02,1.53 | 103.38,1.4 D4.A | R5.2 73.08,1.25 v73.66,1.27
  Top 0.3: IC3.12 51.41,4.7 | IC3.10 50.41,4.84 50.55,4.7 | IC3.11 50.91,4.81 50.8,4.7 | R8.2 95.56,1.72 v96.01,1.27
  Top 0.406: v59.13,1.02 59.08,1.02 | 57.04,1.25 D1.C
  Top 0.5: 101.98,1.27 v101.98,0.76 v101.98,1.52 | 101.98,1.27 D4.A | 101.98,1.27 100.46,1.27 C24.1 | CON2.1 104.01,6.73 105.28,5.46 105.28,1.78 104.9,1.4 103.38,1.4 | D1.C 55.75,1.27 54.74,2.29 C14.1 51.95,3.81 51.82,3.81 51.44,4.19 51.44,4.67 51.41,4.7 50.8,4.7 50.55,4.7 | D6.C 73.79,1.14 v73.66,1.27 | 59.08,1.02 58.85,1.25 57.04,1.25
  Bottom 0.3: v96.01,1.27 96.01,0.64
  Bottom 0.5: 73.53,0.64 79.25,0.64 96.01,0.64 101.85,0.64 v101.98,0.76 v101.98,1.52 | 73.53,0.64 59.56,0.64 v59.13,1.02 | v73.66,1.27 73.66,0.76 73.53,0.64
VCC  (via drill 0.3)
  Top 0.15: IC1.30 61.1,7.25 60.33,6.48 59.94,6.48 C4.1 | IC2.8 70.74,14.48 C8.1 71.12,13.97 71.25,13.84 72.01,13.84 72.14,13.72 R12.2 v72.14,12.06 | IC2.1 66.84,15.28 C5.1 R13.2 v64.64,15.24 | IC1.9 67.02,5.5 67.44,5.08 C7.1 v69.34,5.08 | C4.1 59.69,6.22 | CON7.1 58.45,5.36 59.31,6.22 C4.1 | U$2.1 80.66,4.71 v80.01,4.06 | R1.2 59.56,11.69 C15.1
  Top 0.25: IC3.14 53.1,6.85 v53.21,6.6
  Top 0.3: R2.2 47.88,12.7 48.64,13.46 52.83,13.46 53.21,13.08 v53.21,12.7
  Top 0.5: v53.21,12.7 v53.21,11.81 | v53.21,11.81 53.21,11.3 | v53.21,10.03 v53.21,10.92 53.21,11.3 | L1.2 53.21,11.3 | C15.1 53.34,11.69 v53.21,11.81
  Bottom 0.3: v53.21,6.6 v53.21,10.03
  pour Route2: 109.47,15.49 105.92,15.49 105.92,12.19 86.23,12.19 86.23,15.49 45.47,15.49 45.47,0.38 109.47,0.38
VCC_E  (via drill 0.3)
  Top 0.15: R7.2 33.66,12.45 v32.89,13.21
  Top 0.5: U$1.21 14.73,12.95 15.37,13.59 C10.1 C9.1 16.64,15.11 16.89,15.37 21.59,15.37 23.62,13.34 26.04,13.34 27.02,14.32 CON5.2
  Bottom 0.15: v32.89,13.21 28.54,13.21 CON5.2